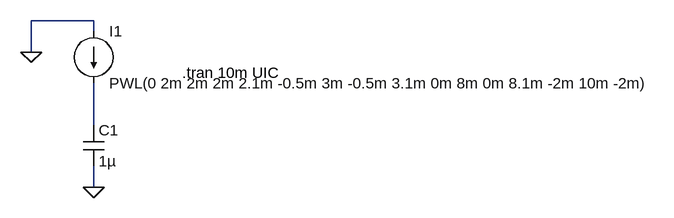
[diagram p0: schematic piecewise-current.asc]
piecewise-current.asc, the LTspice schematic file:
Version 4
SHEET 1 1352 680
WIRE 464 80 368 80
WIRE 464 96 464 80
WIRE 368 128 368 80
WIRE 464 240 464 176
WIRE 464 336 464 304
FLAG 464 336 0
FLAG 368 128 0
SYMBOL cap 448 240 R0
SYMATTR InstName C1
SYMATTR Value 1µ
SYMBOL current 464 96 R0
SYMATTR InstName I1
SYMATTR Value PWL(0 2m 2m 2m 2.1m -0.5m 3m -0.5m 3.1m 0m 8m 0m 8.1m -2m 10m -2m)
TEXT 600 160 Left 2 !.tran 10m UIC

The netlist it stands for:
* piecewise-current.asc
C1 N001 0 1µ
I1 0 N001 PWL(0 2m 2m 2m 2.1m -0.5m 3m -0.5m 3.1m 0m 8m 0m 8.1m -2m 10m -2m)
.tran 10m UIC
.backanno
.end